# EAGLE design RHD2132 (EAGLE 5.11)
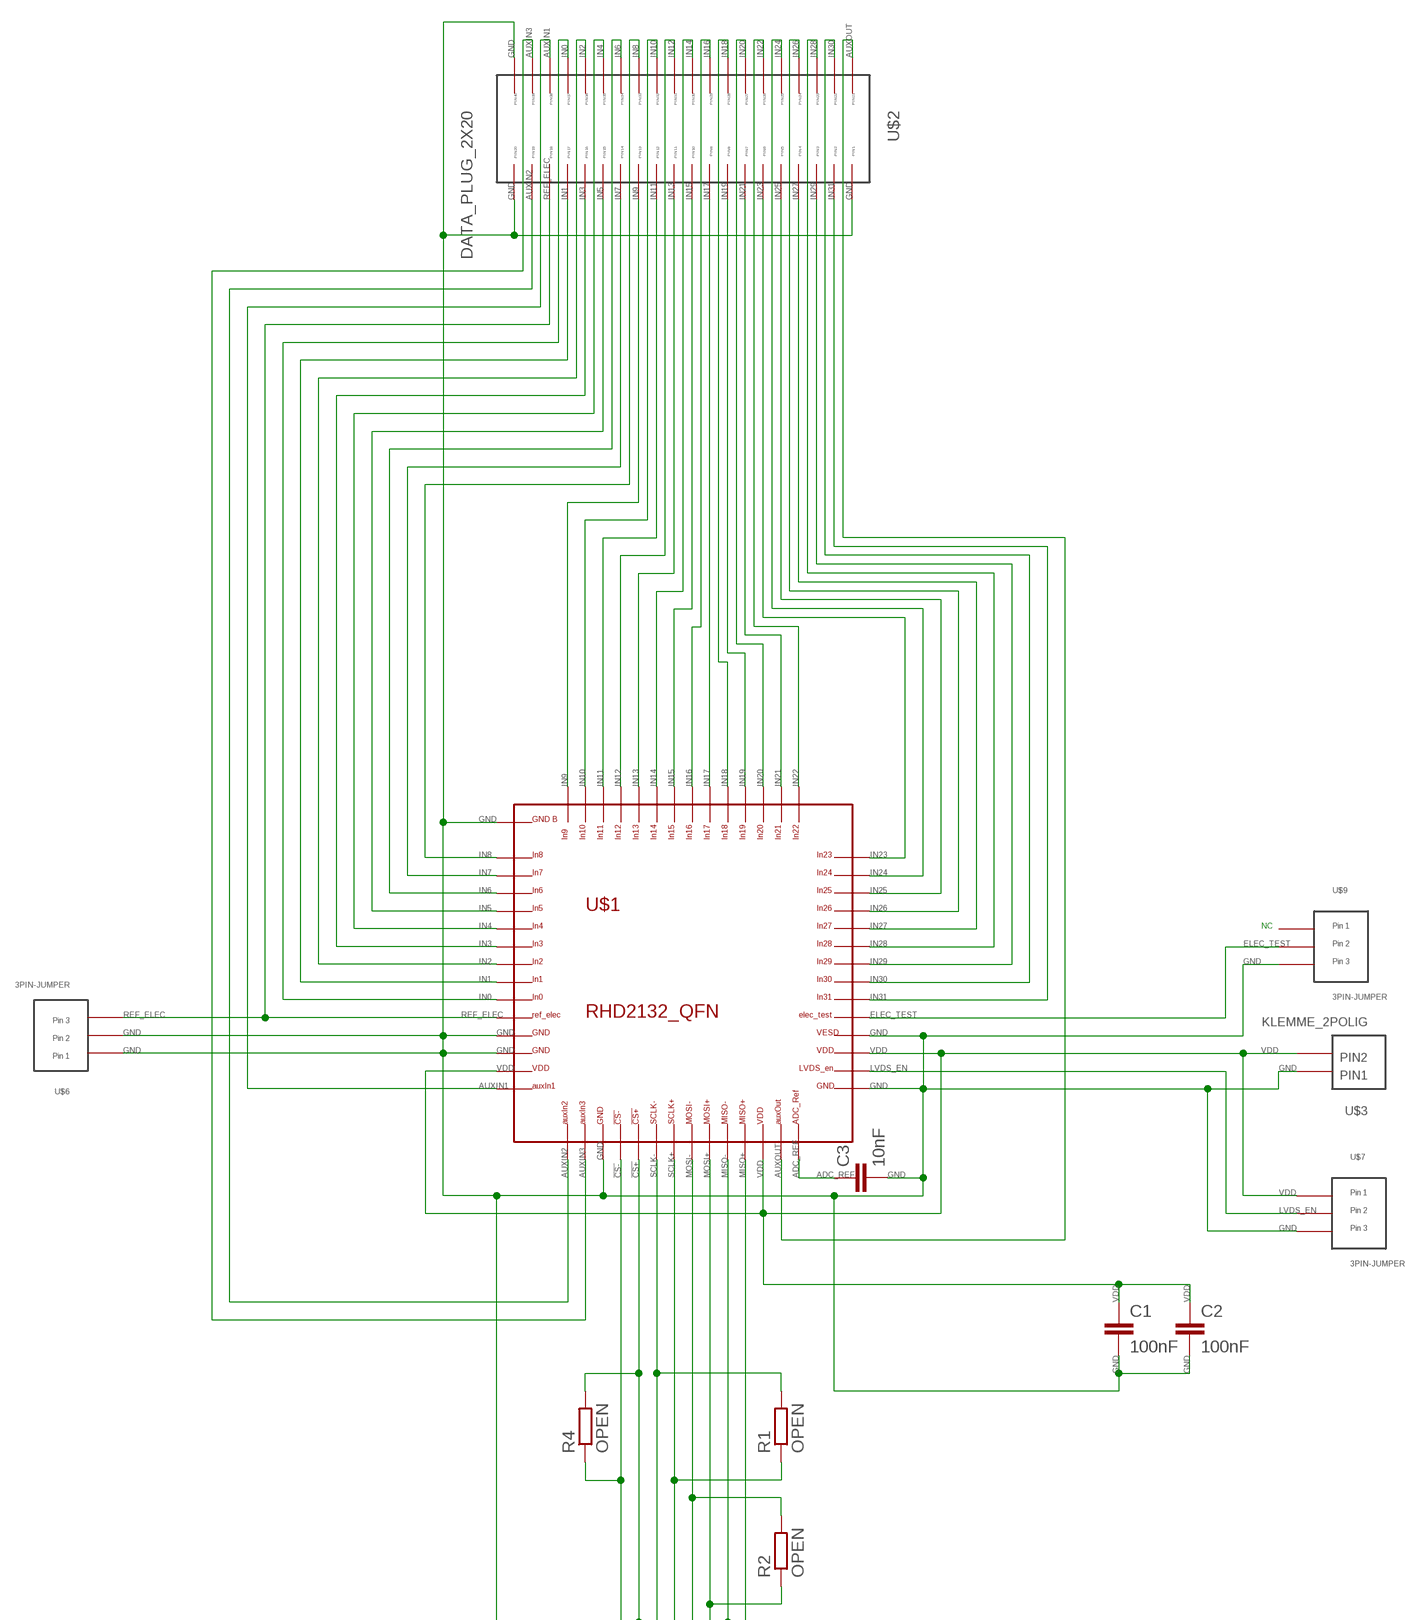
[diagram p0: schematic, sheet 1, part 1 of 2]
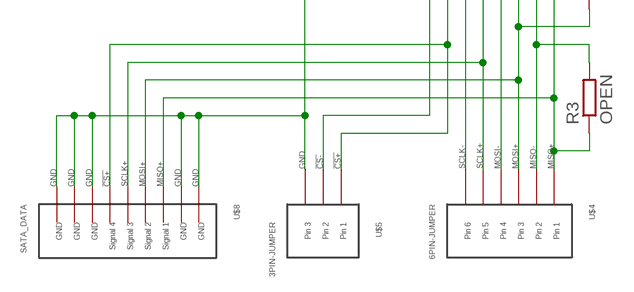
[diagram p1: schematic, sheet 1, part 2 of 2]

## Parts
C1  100nF  C-EUC0805  [C0805]
C2  100nF  C-EUC0805  [C0805]
C3  10nF  C-EUC0805  [C0805]
R1  OPEN  R-EU_R0805  [R0805]
R2  OPEN  R-EU_R0805  [R0805]
R3  OPEN  R-EU_R0805  [R0805]
R4  OPEN  R-EU_R0805  [R0805]
U$1  RHD2132_QFN  [RHD2132_QFN]
U$2  DATA_PLUG_2X20  [HEADER_2X20_GERADE]
U$3  KLEMME_2POLIG  [KLEMME_2POL_PACK]
U$4  6PIN-JUMPER  [6PIN_JUMPER]
U$5  3PIN-JUMPER  [3PIN_JUMPER]
U$6  3PIN-JUMPER  [3PIN_JUMPER]
U$7  3PIN-JUMPER  [3PIN_JUMPER]
U$8  SATA_DATA  [MOLEX_SATA_PLUG]
U$9  3PIN-JUMPER  [3PIN_JUMPER]

## Nets
!CS+: R4.2 U$1.P$19 U$5.P$1 U$8.P$6
!CS-: R4.1 U$1.P$18 U$5.P$2
ADC_REF: C3.1 U$1.P$28
AUXIN1: U$1.P$14 U$2.P$38
AUXIN2: U$1.P$15 U$2.P$19
AUXIN3: U$1.P$16 U$2.P$39
AUXOUT: U$1.P$27 U$2.P$21
ELEC_TEST: U$1.P$33 U$9.P$2
GND: C1.2 C2.2 C3.2 U$1.P$11 U$1.P$12 U$1.P$17 U$1.P$29 U$1.P$32 U$1.P$57 U$2.P$1 U$2.P$20 U$2.P$40 U$3.P$1 U$5.P$3 U$6.P$1 U$6.P$2 U$7.P$3 U$8.P$1 U$8.P$4 U$8.P$7 U$8.P$8 U$8.P$9 U$9.P$3
IN0: U$1.P$9 U$2.P$37
IN1: U$1.P$8 U$2.P$17
IN2: U$1.P$7 U$2.P$36
IN3: U$1.P$6 U$2.P$16
IN4: U$1.P$5 U$2.P$35
IN5: U$1.P$4 U$2.P$15
IN6: U$1.P$3 U$2.P$34
IN7: U$1.P$2 U$2.P$14
IN8: U$1.P$1 U$2.P$33
IN9: U$1.P$56 U$2.P$13
IN10: U$1.P$55 U$2.P$32
IN11: U$1.P$54 U$2.P$12
IN12: U$1.P$53 U$2.P$31
IN13: U$1.P$52 U$2.P$11
IN14: U$1.P$51 U$2.P$30
IN15: U$1.P$50 U$2.P$10
IN16: U$1.P$49 U$2.P$29
IN17: U$1.P$48 U$2.P$9
IN18: U$1.P$47 U$2.P$28
IN19: U$1.P$46 U$2.P$8
IN20: U$1.P$45 U$2.P$27
IN21: U$1.P$44 U$2.P$7
IN22: U$1.P$43 U$2.P$26
IN23: U$1.P$42 U$2.P$6
IN24: U$1.P$41 U$2.P$25
IN25: U$1.P$40 U$2.P$5
IN26: U$1.P$39 U$2.P$24
IN27: U$1.P$38 U$2.P$4
IN28: U$1.P$37 U$2.P$23
IN29: U$1.P$36 U$2.P$3
IN30: U$1.P$35 U$2.P$22
IN31: U$1.P$34 U$2.P$2
LVDS_EN: U$1.P$30 U$7.P$2
MISO+: R3.1 U$1.P$25 U$4.P$1 U$8.P$2
MISO-: R3.2 U$1.P$24 U$4.P$2
MOSI+: R2.1 U$1.P$23 U$4.P$3 U$8.P$3
MOSI-: R2.2 U$1.P$22 U$4.P$4
REF_ELEC: U$1.P$10 U$2.P$18 U$6.P$3
SCLK+: R1.1 U$1.P$21 U$4.P$5 U$8.P$5
SCLK-: R1.2 U$1.P$20 U$4.P$6
VDD: C1.1 C2.1 U$1.P$13 U$1.P$26 U$1.P$31 U$3.P$2 U$7.P$1
Unconnected: U$9.P$1

## Notes on the sheet
- NC

## Library data of the parts
C1-C3 = rcl:C-EU: CAPACITOR, European symbol
R1-R4 = rcl:R-EU_: RESISTOR, European symbol
U$1 = RHD2132_QFN:RHD2132_QFN
U$2 = mypowerlib:DATA_PLUG_2X20: HARTING - 09 18 540 7324 - IDC STRGHT HEADER,40 WAY http://de.farnell.com/harting/09-18-540-7324/idc-strght-header-40-way/dp/1096993?Ntt=HARTING+header+40+way
U$3 = mypowerlib:KLEMME_2POLIG
U$4 = mylibs:6PIN-JUMPER
U$5-U$7 U$9 = mylibs:3PIN-JUMPER
U$8 = mylibs:SATA_DATA

## Board
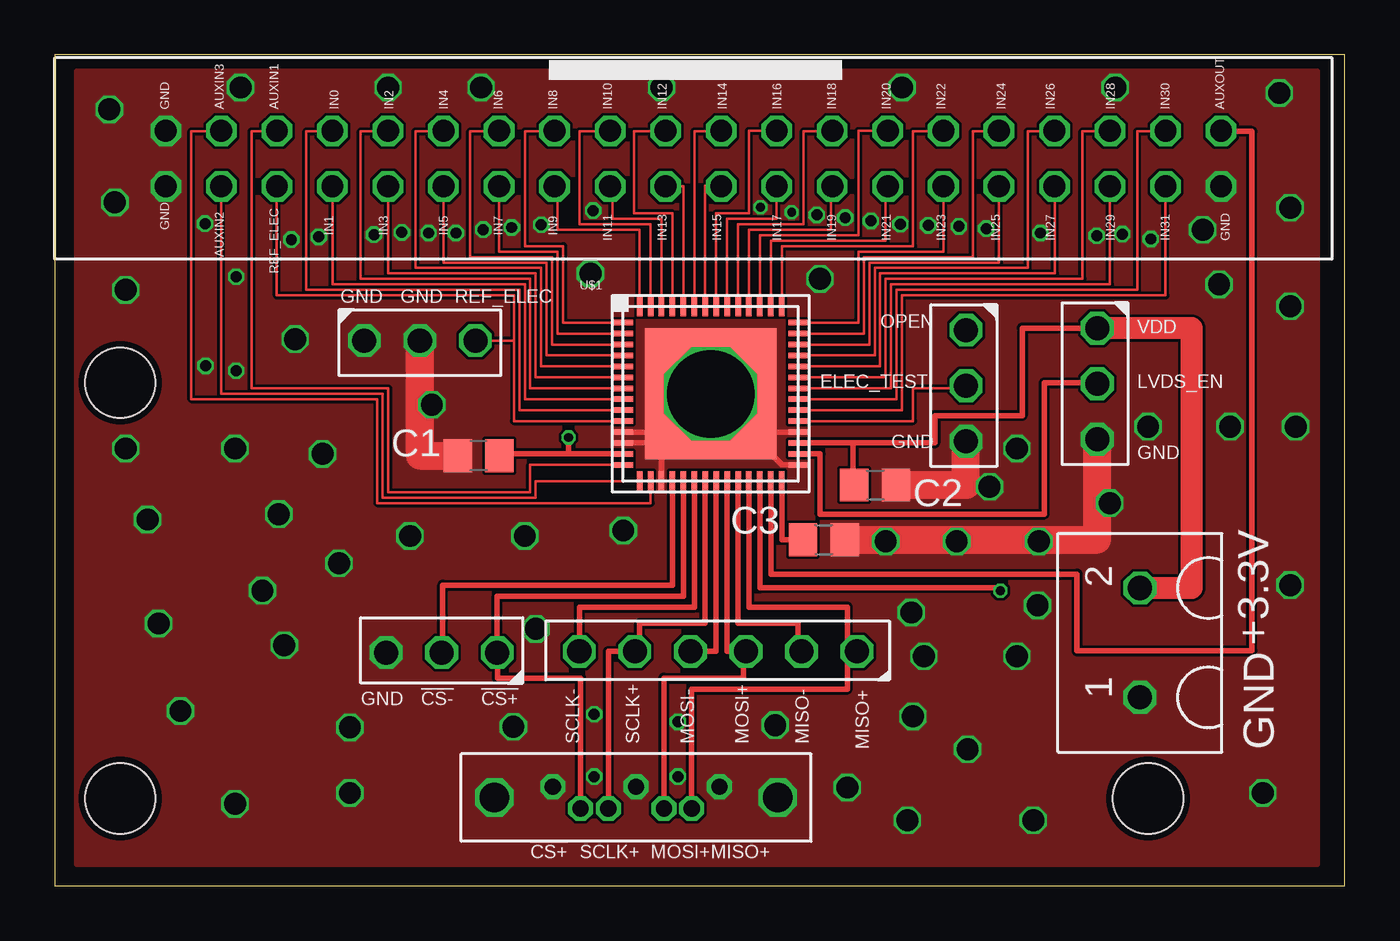
[diagram p2: board, top side]
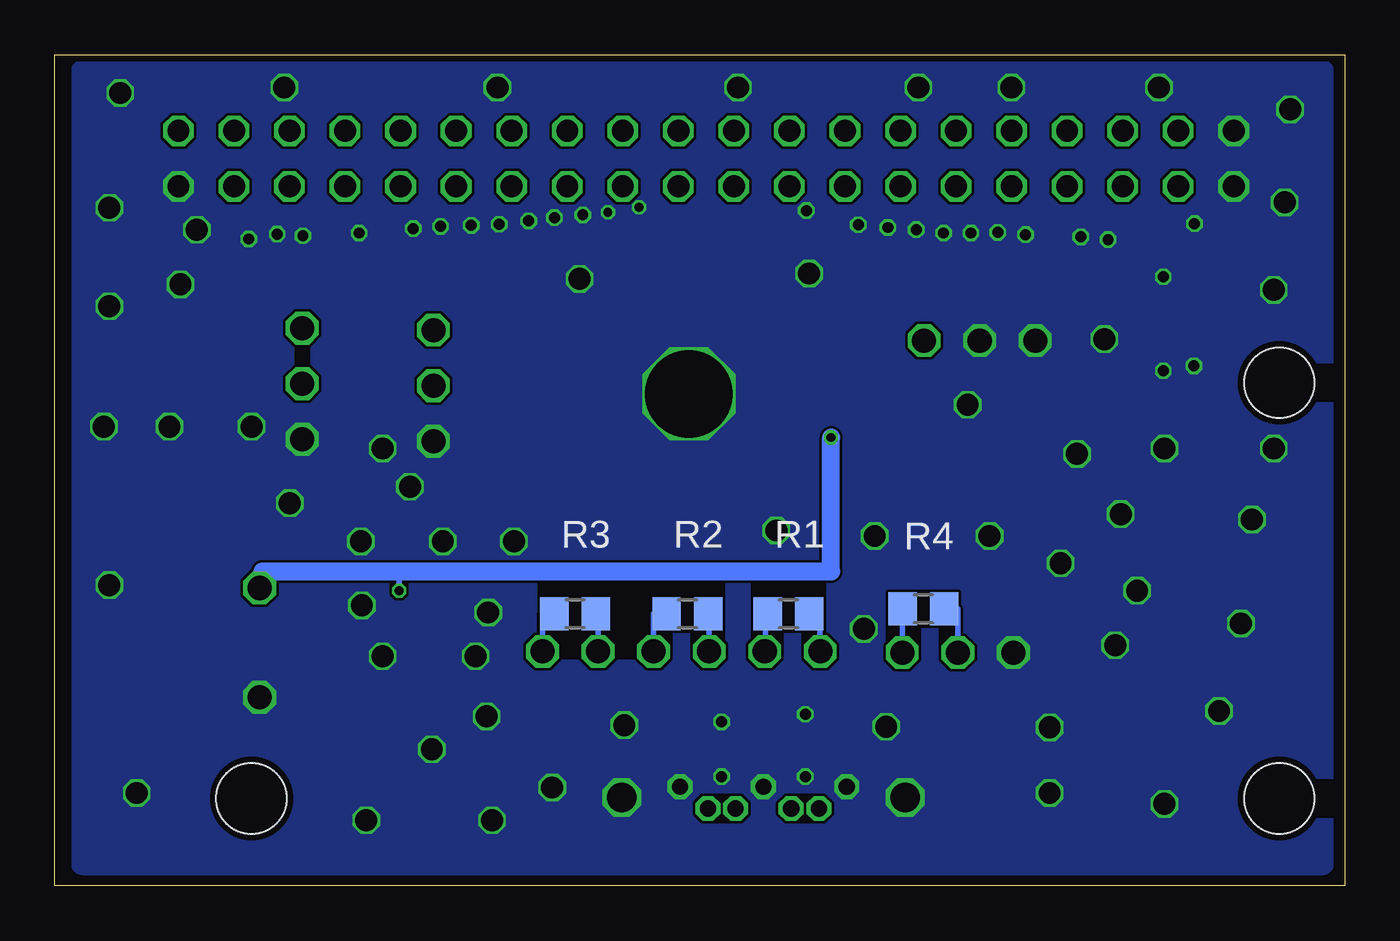
[diagram p3: board, bottom side, seen from below]

Size 59 x 38 mm. Coordinates in mm from the lower left corner, seen from the top.
Outline: 0,0 59,0 59,38 0,38 0,0
Copper layers (1*16): Top 0.035mm / dielectric 1.5mm / Bottom 0.035mm
Design rules "PCB-POOL HighSpec": minimum track width 0.125mm, minimum drill 0.2mm, track to track 0.125mm, track to pad 0.125mm, pad to pad 0.125mm, via to via 0.125mm, smd to smd 0.125mm, copper to edge 0.3mm, drill to drill 0.2mm, minimum pad ring 0.2mm, minimum via ring 0.125mm, stop-mask expansion 0.075mm, vias tented up to drill 0mil, thermal gap 0.2mm
Holes 3.2 mm at 3,4 50,4 3,23

### Footprints (pad centres in the part's own frame; a part is rotated, then mirrored left to right if it is on the bottom)
C0805 = smd 1.3 x 1.5: 1 -0.95,0; 2 0.95,0
R0805 = smd 1.3 x 1.5: 1 -0.95,0; 2 0.95,0
RHD2132_QFN = smd 0.9 x 0.25: P$1 -4,3.25; P$2 -4,2.75; P$3 -4,2.25; P$4 -4,1.75; P$5 -4,1.25; P$6 -4,0.75; P$7 -4,0.25; P$8 -4,-0.25; P$9 -4,-0.75; P$10 -4,-1.25; P$11 -4,-1.75; P$12 -4,-2.25; P$13 -4,-2.75; P$14 -4,-3.25; P$29 4,-3.25; P$30 4,-2.75; P$31 4,-2.25; P$32 4,-1.75; P$33 4,-1.25; P$34 4,-0.75; P$35 4,-0.25; P$36 4,0.25; P$37 4,0.75; P$38 4,1.25; P$39 4,1.75; P$40 4,2.25; P$41 4,2.75; P$42 4,3.25 | smd 0.25 x 0.9: P$15 -3.25,-4; P$16 -2.75,-4; P$17 -2.25,-4; P$18 -1.75,-4; P$19 -1.25,-4; P$20 -0.75,-4; P$21 -0.25,-4; P$22 0.25,-4; P$23 0.75,-4; P$24 1.25,-4; P$25 1.75,-4; P$26 2.25,-4; P$27 2.75,-4; P$28 3.25,-4; P$43 3.25,4; P$44 2.75,4; P$45 2.25,4; P$46 1.75,4; P$47 1.25,4; P$48 0.75,4; P$49 0.25,4; P$50 -0.25,4; P$51 -0.75,4; P$52 -1.25,4; P$53 -1.75,4; P$54 -2.25,4; P$55 -2.75,4; P$56 -3.25,4 | smd 6 x 6: P$57 0,0
HEADER_2X20_GERADE = drill 1 octagon: P$1 -24.13,1.27; P$2 -21.59,1.27; P$3 -19.05,1.27; P$4 -16.51,1.27; P$5 -13.97,1.27; P$6 -11.43,1.27; P$7 -8.89,1.27; P$8 -6.35,1.27; P$9 -3.81,1.27; P$10 -1.27,1.27; P$11 1.27,1.27; P$12 3.81,1.27; P$13 6.35,1.27; P$14 8.89,1.27; P$15 11.43,1.27; P$16 13.97,1.27; P$17 16.51,1.27; P$18 19.05,1.27; P$19 21.59,1.27; P$20 24.13,1.27; P$21 -24.13,-1.27; P$22 -21.59,-1.27; P$23 -19.05,-1.27; P$24 -16.51,-1.27; P$25 -13.97,-1.27; P$26 -11.43,-1.27; P$27 -8.89,-1.27; P$28 -6.35,-1.27; P$29 -3.81,-1.27; P$30 -1.27,-1.27; P$31 1.27,-1.27; P$32 3.81,-1.27; P$33 6.35,-1.27; P$34 8.89,-1.27; P$35 11.43,-1.27; P$36 13.97,-1.27; P$37 16.51,-1.27; P$38 19.05,-1.27; P$39 21.59,-1.27; P$40 24.13,-1.27
KLEMME_2POL_PACK = drill 1.1 octagon: P$1 -2.5,0; P$2 2.5,0
6PIN_JUMPER = drill 1.1 octagon: P$1 -7.62,0; P$2 -5.08,0; P$3 -2.54,0; P$4 0,0; P$5 2.54,0; P$6 5.08,0
3PIN_JUMPER = drill 1.1 octagon: P$1 -2.54,0; P$2 0,0; P$3 2.54,0
MOLEX_SATA_PLUG = drill 0.74 pad 1.016 octagon: P$1 -3.81,-0.5; P$2 -2.54,0.5; P$3 -1.27,0.5; P$4 0,-0.5; P$5 1.27,0.5; P$6 2.54,0.5; P$7 3.81,-0.5 | drill 1.35 octagon: P$8 -6.48,0; P$9 6.48,0

### Placement (x,y rotation side)
C1  19.38,19.67 180 top
C2  37.52,18.33 0 top
C3  35.17,15.83 0 top
R1  25.44,12.44 0 bottom
R2  30.07,12.44 0 bottom
R3  35.2,12.44 0 bottom
R4  19.28,12.67 180 bottom
U$1  30,22.5 0 top
U$2  29.21,33.25 180 top
U$3  49.63,11.12 90 top
U$4  29.07,10.72 180 top
U$5  17.7,10.67 180 top
U$6  16.7,24.93 0 top
U$7  47.68,22.96 270 top
U$8  26.59,4.04 180 top
U$9  41.68,22.87 270 top

### Tracks (layer width: path | path; a pad name or v marks a point on that pad's centre or on a via)
!CS+
  Top 0.25: U$1.P$19 28.75,13.25 20.24,13.25 U$5.P$1 20.25,9.5 24.05,9.5 U$8.P$6
  Bottom 0.25: 20.25,12.67 R4.2 U$5.P$1
!CS-
  Top 0.25: U$1.P$18 28.25,13.75 17.75,13.75 17.75,10.67 U$5.P$2
  Bottom 0.25: R4.1 17.7,12.67 U$5.P$2
ADC_REF
  Top 0.25: U$1.P$28 33.25,15.83 C3.1
AUXIN1
  Top 0.125: U$1.P$14 21.75,19.25 21.75,18 15.25,18 15.25,22.75 9,22.75 9,34.5 10.16,34.5 U$2.P$38
AUXIN2
  Top 0.125: U$1.P$15 22,18.5 22,17.75 15,17.75 15,22.5 7.62,22.5 U$2.P$19
AUXIN3
  Top 0.125: U$1.P$16 27.25,17.5 14.75,17.5 14.75,22.25 6.25,22.25 6.25,34.5 7.62,34.5 U$2.P$39
AUXOUT
  Top 0.25: U$1.P$27 32.75,14.25 46.75,14.25 46.75,10.75 54.75,10.75 54.75,34.5 53.34,34.5 U$2.P$21
ELEC_TEST
  Top 0.125: U$1.P$33 39.25,21.25 39.25,22.75 41.68,22.75 U$9.P$2
GND  (via drill 0.4, 0.5, 1, 4)
  Top 0.25: 30,20.75 U$1.P$32 | 30,20.75 U$1.P$11 | U$1.P$57 30,20.75 | U$1.P$12 30,20.25 U$1.P$57 | U$1.P$17 27.75,22.5 29.75,22.5 | 29.75,22.5 U$1.P$57 | U$1.P$29 33.25,19.25 30.5,22 30.25,22 29.75,22.5
  Top 1.27: C2.2 41.68,18.33 U$9.P$3 | C3.2 47.68,15.83 U$7.P$3 | C1.2 16.7,19.67 U$6.P$2
  other vias: 30,22.5 2.5,35.5 2.75,31.25 11,25 17.25,22 26,16.25 21.5,16 16.25,16 12.25,19.75 10.25,17 3.25,27.25 3.25,20 8.25,20 4.25,16.75 9.5,13.5 4.75,12 5.75,8 10.5,11 13,14.75 8.25,3.75 13.5,7.25 13.5,4.25 36.25,4.5 39,3 39.75,10.5 41.75,6.25 44.75,3 44,10.5 48.25,17.5 42.75,18.25 53.25,27.5 50,21 53.75,21 56.5,26.5 56.75,21 56.5,13.75 55.25,4.25 56.5,31 52.5,30 38.75,36.5 27.75,36.5 15.25,36.5 19.5,36.5 56,36.25 48.5,36.5 8.5,36.5 35,27.75 24.5,28 41.25,15.75 39.25,7.75 45,15.75 38,15.75 44,20 22,11.75 24.68,7.85 24.68,5 28.5,5 28.5,7.5 12.07,29.67 14.6,29.78 15.88,29.88 17.1,29.85 18.35,29.85 19.6,30 20.9,30.1 22.25,30.22 24.62,30.88 37.33,30.4 36.15,30.55 34.85,30.67 33.7,30.8 38.67,30.25 39.95,30.2 41.35,30.15 48.83,29.8 47.65,29.72 45.08,29.85 42.6,30.05 32.27,31.03 10.82,29.55 8.3,27.85 6.88,30.28 6.9,23.78 8.3,23.55 50.12,29.58 20.98,7.28 32.95,7.35 44.95,12.83 39.17,12.5
  pour Bottom (no thermals): 1,37.25 57.75,37.25 57.75,1 1,1
  pour Top (no thermals): 9.75,26.25 18,26.25 18,23.25 9.75,23.25
  pour Top (rank 2, no thermals): 1,37.25 57.75,37.25 57.75,1 1,1
IN0
  Top 0.125: U$1.P$9 21.25,21.75 21.25,27.25 11.5,27.25 11.5,34.5 12.75,34.5
  Top 0.25: 12.75,34.5 12.7,34.5 U$2.P$37
IN1
  Top 0.125: U$1.P$8 21.5,22.25 21.5,27.5 12.7,27.5 U$2.P$17
IN2
  Top 0.125: U$1.P$7 21.75,22.75 21.75,27.75 14,27.75 14,34.5 15.25,34.5
  Top 0.25: 15.25,34.5 15.24,34.5 U$2.P$36
IN3
  Top 0.125: U$1.P$6 22,23.25 22,28 15.25,28 15.25,32 15.24,32 U$2.P$16
IN4
  Top 0.125: U$1.P$5 22.25,23.75 22.25,28.25 16.5,28.25 16.5,34.5 17.78,34.5 U$2.P$35
IN5
  Top 0.125: U$1.P$4 22.5,24.25 22.5,28.5 17.78,28.5 U$2.P$15
IN6
  Top 0.125: U$1.P$3 22.75,24.75 22.75,28.75 19,28.75 19,34.5 20.32,34.5 U$2.P$34
IN7
  Top 0.125: U$1.P$2 23,25.25 23,29 20.32,29 U$2.P$14
IN8
  Top 0.125: U$1.P$1 23.25,25.75 23.25,29.25 21.5,29.25 21.5,34.5 22.86,34.5 U$2.P$33
IN9
  Top 0.125: U$1.P$56 26.75,30 23,30 23,31.98 U$2.P$13
IN10
  Top 0.125: U$1.P$55 27.25,30.25 24,30.25 24,34.5 25.4,34.5 | 25.4,34.5 U$2.P$32 | 25.4,34.5 25.5,34.5
IN11
  Top 0.125: U$1.P$54 27.75,30.5 25.5,30.5 25.5,31.98 U$2.P$12
IN12
  Top 0.125: U$1.P$53 28.25,30.75 26.5,30.75 26.5,34.5 28,34.5 28,34.52 U$2.P$31
IN13
  Top 0.125: U$1.P$52 28.75,31.98 U$2.P$11
IN14
  Top 0.125: U$1.P$51 29.25,34.5 30.5,34.5
  Top 0.25: 30.5,34.5 30.48,34.5 U$2.P$30
IN15
  Top 0.125: U$1.P$50 29.75,32 30.5,32 30.5,31.98 U$2.P$10
IN16
  Top 0.125: U$1.P$49 30.25,30.75 31.75,30.75 31.75,34.52 U$2.P$29
IN17
  Top 0.125: U$1.P$48 30.75,30.5 33,30.5 33,31.98 U$2.P$9
IN18
  Top 0.125: U$1.P$47 31.25,30.25 34.25,30.25 34.25,34.5 35.5,34.5 35.5,34.52 U$2.P$28
IN19
  Top 0.125: U$1.P$46 31.75,30 35.5,30 35.5,31.98 U$2.P$8
IN20
  Top 0.125: U$1.P$45 32.25,29.75 36.75,29.75 36.75,34.52 U$2.P$27
IN21
  Top 0.125: U$1.P$44 32.75,29.5 38,29.5 38,31.98 U$2.P$7
IN22
  Top 0.125: U$1.P$43 33.25,29.25 39.25,29.25 39.25,34.5 40.75,34.5 40.75,34.52 U$2.P$26
IN23
  Top 0.125: U$1.P$42 36.75,25.75 36.75,29 40.64,29 U$2.P$6
IN24
  Top 0.125: U$1.P$41 37,25.25 37,28.75 42,28.75 42,34.5 43.18,34.5 U$2.P$25
IN25
  Top 0.125: U$1.P$40 37.25,24.75 37.25,28.5 43.18,28.5 U$2.P$5
IN26
  Top 0.125: U$1.P$39 37.5,24.25 37.5,28.25 44.5,28.25 44.5,34.5 45.75,34.5
  Top 0.25: 45.75,34.5 45.72,34.5 U$2.P$24
IN27
  Top 0.125: U$1.P$38 37.75,23.75 37.75,28 45.75,28 45.75,32 45.72,32 U$2.P$4
IN28
  Top 0.125: U$1.P$37 38,23.25 38,27.75 47,27.75 47,34.5 48.26,34.5 U$2.P$23
IN29
  Top 0.125: U$1.P$36 38.25,22.75 38.25,27.5 48.26,27.5 U$2.P$3
IN30
  Top 0.125: U$1.P$35 38.5,22.25 38.5,27.25 49.5,27.25 49.5,34.5 50.8,34.5 U$2.P$22
IN31
  Top 0.125: U$1.P$34 38.75,21.75 38.75,27 50.8,27 U$2.P$2
LVDS_EN
  Top 0.25: U$7.P$2 47.68,23 45.25,23 45.25,17 35,17 35,19.75 U$1.P$30
MISO+
  Top 0.25: U$1.P$25 31.75,12.75 36.25,12.75 36.25,10.72 | 36.25,10.72 U$4.P$1 | U$8.P$2 29.13,9 36.25,9 36.25,10.72
  Bottom 0.25: R3.1 36.69,12.44 U$4.P$1
MISO-
  Top 0.25: U$1.P$24 31.25,12 34,12 34,10.72 U$4.P$2
  Bottom 0.25: R3.2 34.15,12.44 U$4.P$2
MOSI+
  Top 0.25: U$1.P$23 30.75,10.72 U$4.P$3 31.5,10.72 31.5,9.5 27.86,9.5 U$8.P$3
  Bottom 0.25: R2.1 31.61,12.44 U$4.P$3
MOSI-
  Top 0.25: U$1.P$22 30.25,10.72 U$4.P$4
  Bottom 0.25: R2.2 29.07,12.44 U$4.P$4
REF_ELEC
  Top 0.125: U$1.P$10 21,21.25 21,24.93 | U$2.P$18 10.16,27 21,27 21,24.93 | 21,24.93 U$6.P$3
SCLK+
  Top 0.25: U$1.P$21 29.75,12 26.75,12 26.75,10.75 26.5,10.75 26.5,10.72 U$4.P$5 25.32,10.72 U$8.P$5
  Bottom 0.25: R1.1 26.5,12.44 26.5,10.75 26.53,10.75 U$4.P$5
SCLK-
  Top 0.25: U$1.P$20 29.25,12.75 24,12.75 24,10.75 23.99,10.75 U$4.P$6
  Bottom 0.25: R1.2 24,12.44 24,10.75 23.99,10.75 U$4.P$6
VDD  (via drill 0.4)
  Top 0.25: C1.1 20.33,19.75 U$1.P$13 23.5,19.75 v23.5,20.5 | 36.5,20.25 U$1.P$31 | 36.5,20.25 40.25,20.25 40.25,21.5 44.25,21.5 44.25,25.5 47.5,25.5 U$7.P$1 47.75,25.5 | C2.1 36.5,18.33 36.5,20.25 | U$1.P$26 32.25,13.62 43.25,13.62 v43.25,13.5
  Top 1.016: U$3.P$2 52,13.62 52,25.5 47.5,25.5
  Bottom 0.25: 49.5,14.37 43.25,14.25 v43.25,13.5
  Bottom 0.813: v23.5,20.5 23.5,14.37 49.5,14.37 U$3.P$2 49.75,13.62

### Text on the board
tNames: GND | AUXIN3 | AUXIN1 | IN0 | IN2 | IN4 | IN6 | IN8 | IN10 | IN12 | IN14 | IN16 | IN18 | IN20 | IN22 | IN24 | IN26 | IN28 | IN30 | AUXOUT | GND | IN1 | IN3 | IN5 | IN7 | IN9 | IN11 | IN13 | IN15 | IN17 | IN19 | IN21 | IN23 | IN25 | IN27 | IN29 | IN31 | GND | AUXIN2 | REF_ELEC | GND | GND | REF_ELEC | OPEN | VDD | ELEC_TEST | LVDS_EN | GND | GND | +3.3V | GND | !CS- | !CS+ | SCLK- | SCLK+ | MOSI- | MOSI+ | MISO- | MISO+ | GND | !CS+ | SCLK+ | MOSI+ | MISO+